# EAGLE schematic mediator (EAGLE 6.3)
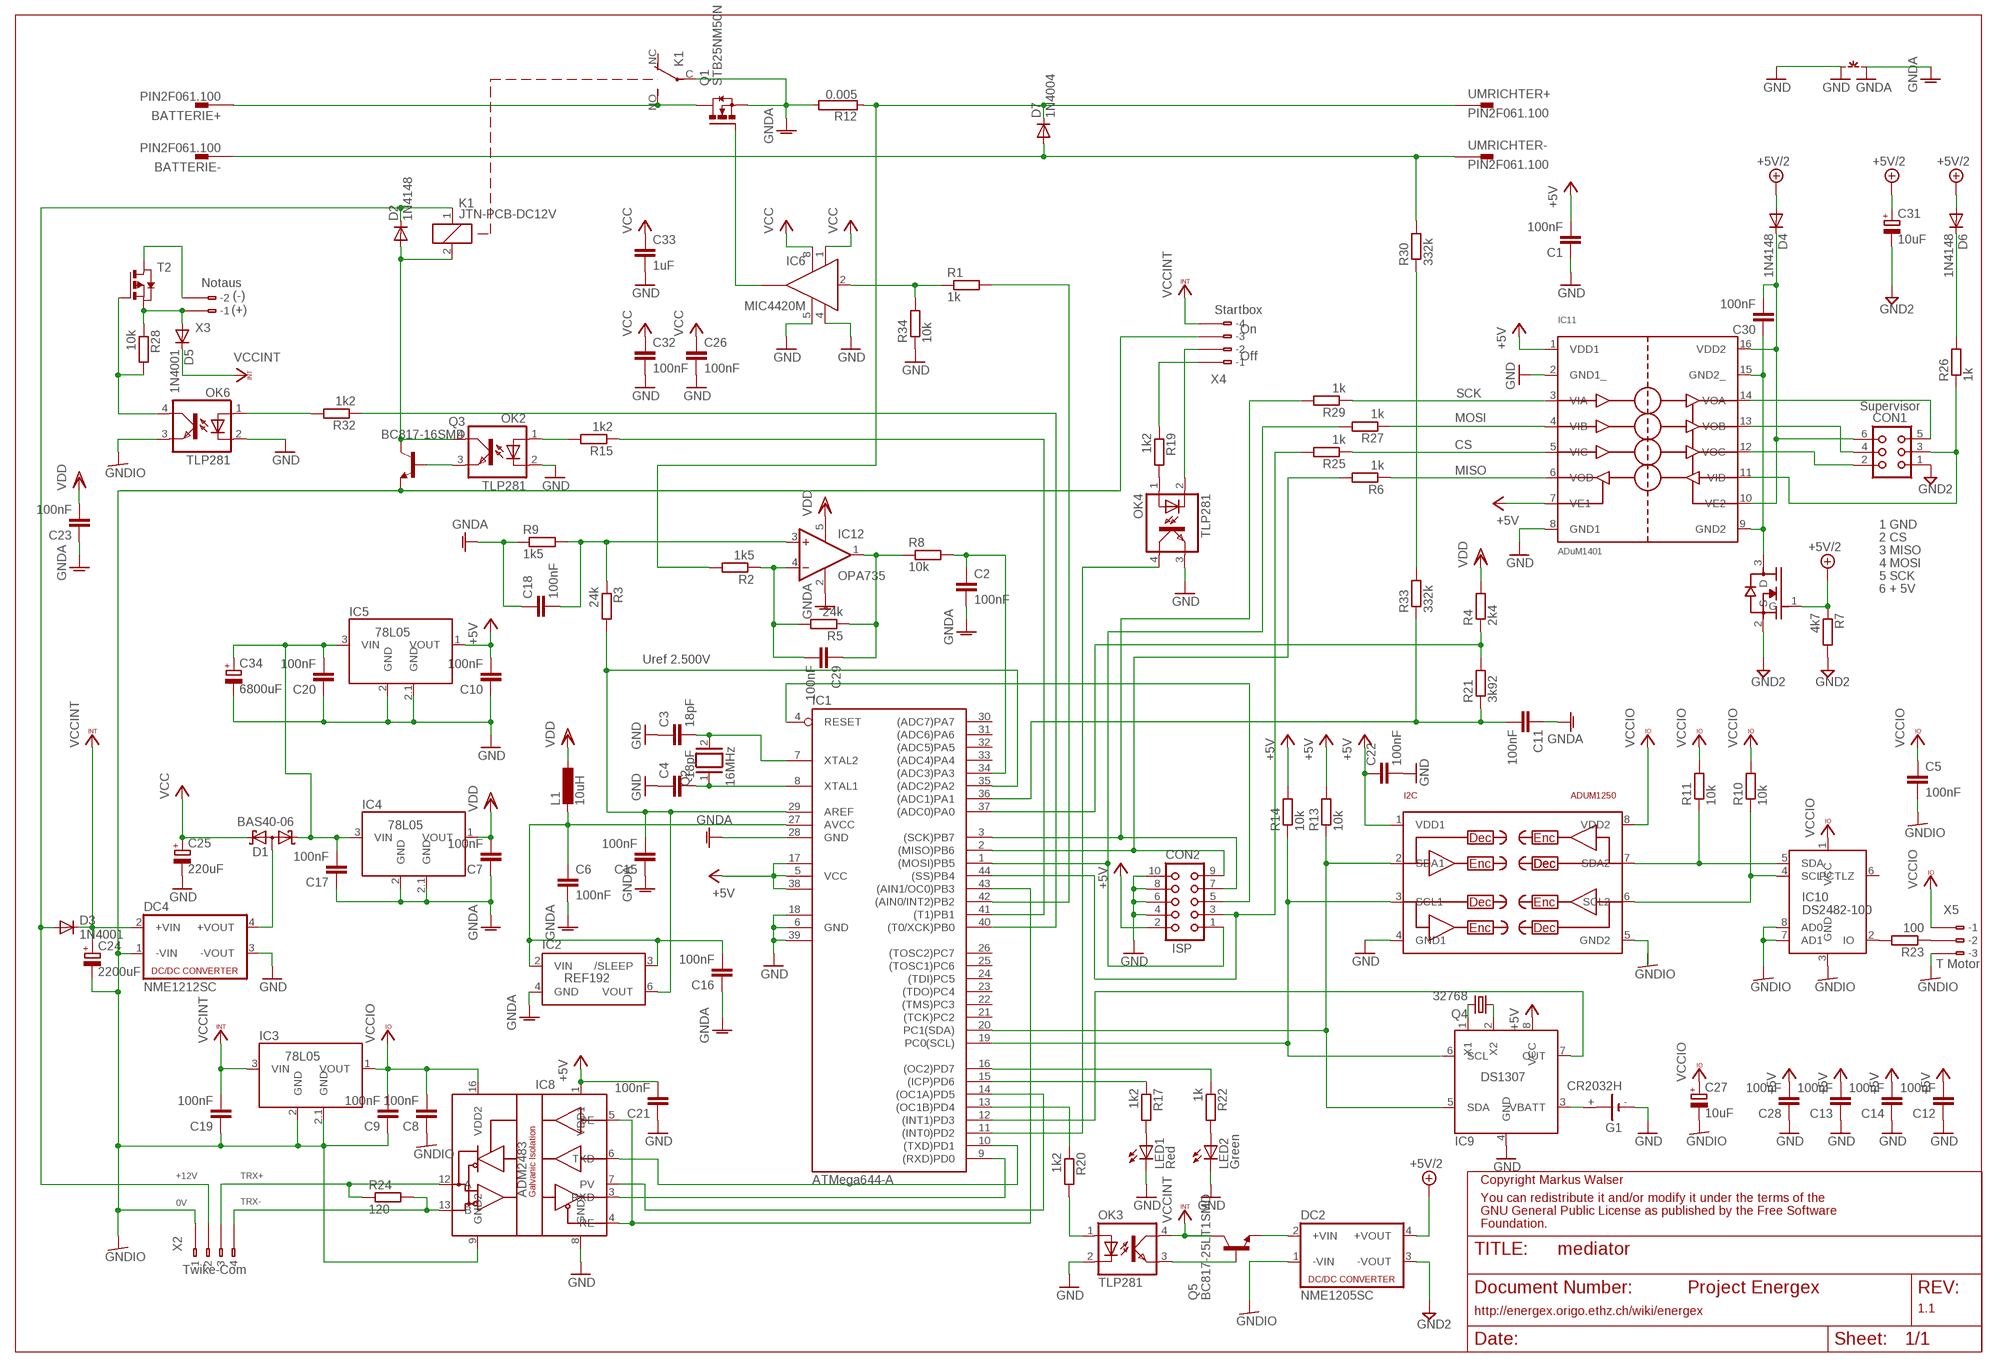
[diagram p0: schematic, sheet 1]

## Parts
BATTERIE+  PIN2F061.100  [F061.100]
BATTERIE-  PIN2F061.100  [F061.100]
C1  100nF  C-EUC0603K  [C0603K]
C2  100nF  C-EUC0603K  [C0603K]
C3  18pF  C-EUC0603K  [C0603K]
C4  18pF  C-EUC0603K  [C0603K]
C5  100nF  C-EUC0603K  [C0603K]
C6  100nF  C-EUC0603K  [C0603K]
C7  100nF  C-EUC0603K  [C0603K]
C8  100nF  C-EUC0603K  [C0603K]
C9  100nF  C-EUC0603K  [C0603K]
C10  100nF  C-EUC0603K  [C0603K]
C11  100nF  C-EUC0603K  [C0603K]
C12  100nF  C-EUC0603K  [C0603K]
C13  100nF  C-EUC0603K  [C0603K]
C14  100nF  C-EUC0603K  [C0603K]
C15  100nF  C-EUC0603K  [C0603K]
C16  100nF  C-EUC0603K  [C0603K]
C17  100nF  C-EUC0603K  [C0603K]
C18  100nF  C-EUC0603K  [C0603K]
C19  100nF  C-EUC0603K  [C0603K]
C20  100nF  C-EUC0603K  [C0603K]
C21  100nF  C-EUC0603K  [C0603K]
C22  100nF  C-EUC0603K  [C0603K]
C23  100nF  C-EUC0603K  [C0603K]
C24  2200uF  CPOL-EUE5-10.5  [E5-10,5]
C25  220uF  CPOL-EUE2.5-6  [E2,5-6]
C26  100nF  C-EUC0603K  [C0603K]
C27  10uF  CPOL-EUSMCA  [SMC_A]
C28  100nF  C-EUC0603K  [C0603K]
C29  100nF  C-EUC0603K  [C0603K]
C30  100nF  C-EUC0603K  [C0603K]
C31  10uF  CPOL-EUSMCA  [SMC_A]
C32  100nF  C-EUC0603K  [C0603K]
C33  1uF  C-EUC0603K  [C0603K]
C34  6800uF  CPOL-EUE7.5-16  [E7,5-16]
CON1  CON06  [CON06]
CON2  CON10  [CON10]
D1  BAS40-06  [SOT23]
D2  1N4148  DIODE-MICROMELF-R  [MICROMELF-R]
D3  1N4001  DIODE-DO214AC  [DO214AC]
D4  1N4148  DIODE-MICROMELF-R  [MICROMELF-R]
D5  1N4001  DIODE-DO214AC  [DO214AC]
D6  1N4148  DIODE-MICROMELF-R  [MICROMELF-R]
D7  1N4004  [DO41-10]
DC2  NME1205SC  NME  [NME]
DC4  NME1212SC  NME  [NME]
G1  CR2032H  [CR2032H]
I2C  ADUM1250  [SO8]
IC1  ATMega644-A  MEGA32-A  [TQFP44]
IC2  REF192  [SO08]
IC3  78L05  [SOT89]
IC4  78L05  [SOT89]
IC5  78L05  [SOT89]
IC6  MIC4420M  [SO-08]
IC8  ADM2483  [SO16W]
IC9  DS1307  [SO08]
IC10  DS2482-100  [SO08]
IC11  ADuM1401  ADUM1401  [SO16W]
IC12  OPA735  OPA743  [SOT23-5]
K1  JTN-PCB-DC12V  [JT-PCB]
L1  10uH  L-EUL3225M  [L3225M]
LED1  Red  LEDCHIPLED_0805  [CHIPLED_0805]
LED2  Green  LEDCHIPLED_0805  [CHIPLED_0805]
OK2  TLP281  TLP283  [MINI-FLAT-4]
OK3  TLP281  TLP283  [MINI-FLAT-4]
OK4  TLP281  TLP283  [MINI-FLAT-4]
OK6  TLP281  TLP283  [MINI-FLAT-4]
Q1  STB25NM50N  IRF3704S  [D2PACK]
Q2  16MHz  XTAL/S  [QS]
Q3  BC817-16SMD  [SOT23-BEC]
Q4  32768  CRYSTALTC26H  [TC26H]
Q5  BC817-25LT1SMD  [SOT23-BEC]
R1  1k  R-EU_R0603  [R0603]
R2  1k5  R-EU_M0805  [M0805]
R3  24k  R-EU_M0805  [M0805]
R4  2k4  R-EU_M0805  [M0805]
R5  24k  R-EU_M0805  [M0805]
R6  1k  R-EU_M0805  [M0805]
R7  4k7  R-EU_R0603  [R0603]
R8  10k  R-EU_M0805  [M0805]
R9  1k5  R-EU_M0805  [M0805]
R10  10k  R-EU_M0805  [M0805]
R11  10k  R-EU_M0805  [M0805]
R12  0.005  RKH208-8  [KH208-8]
R13  10k  R-EU_M0805  [M0805]
R14  10k  R-EU_M0805  [M0805]
R15  1k2  R-EU_R0603  [R0603]
R17  1k2  R-EU_R0603  [R0603]
R19  1k2  R-EU_R0603  [R0603]
R20  1k2  R-EU_R0603  [R0603]
R21  3k92  R-EU_M0805  [M0805]
R22  1k  R-EU_R0603  [R0603]
R23  100  R-EU_M0805  [M0805]
R24  120  R-EU_R0603  [R0603]
R25  1k  R-EU_M0805  [M0805]
R26  1k  R-EU_R0603  [R0603]
R27  1k  R-EU_M0805  [M0805]
R28  10k  R-EU_M0805  [M0805]
R29  1k  R-EU_M0805  [M0805]
R30  332k  R-EU_0207/10  [0207/10]
R32  1k2  R-EU_R0603  [R0603]
R33  332k  R-EU_0207/5V  [0207/5V]
R34  10k  R-EU_R0603  [R0603]
T1  FDN337N  [SOT23]
T2  PMOSSOT23  [SOT-23]
UMRICHTER+  PIN2F061.100  [F061.100]
UMRICHTER-  PIN2F061.100  [F061.100]
X2  233-104  [233-104]
X3  233-102  [233-102]
X4  233-104  [233-104]
X5  233-203  [233-203]
~NUDEV~1  GND-GNDA  [GND-GNDA]

## Nets
+5V: C1.2 C10.2 C12.2 C13.2 C14.2 C21.2 C22.1 C28.2 CON2.2 I2C.1(VDD1) IC1.5(VCC) IC1.17(VCC1) IC1.38(VCC2) IC5.1(VOUT) IC8.1(VDD1) IC9.8(VCC) IC11.1(VDD1) IC11.7(VE1) R13.2 R14.2
+5V/2: C31.+ D4.A D6.A DC2.4(+VOUT) R7.1 T1.1(G)
GND: C1.1 C3.1 C4.1 C10.1 C12.1 C13.1 C14.1 C20.1 C21.1 C22.2 C25.- C26.2 C28.1 C32.2 C33.2 C34.- CON2.4 CON2.6 CON2.8 CON2.10 DC4.3(-VOUT) G1.- I2C.4(GND1) IC1.6(GND) IC1.18(GND1) IC1.39(GND2) IC5.2(GND) IC5.2.1(GND) IC6.4(GND) IC6.5(GND1) IC8.8(GND1) IC9.4(GND) IC11.2(GND1_) IC11.8(GND1) LED1.C LED2.C OK2.2(C) OK3.2(C) OK4.3(EMIT) OK6.2(C) R34.1 ~NUDEV~1.GND
GND2: C31.- CON1.1 DC2.3(-VOUT) R7.2 T1.2(S)
GNDA: C2.2 C6.2 C7.1 C11.1 C15.1 C16.1 C17.1 C18.1 C23.1 IC1.28(GND) IC2.4(GND) IC4.2(GND) IC4.2.1(GND) IC12.2(V-) K1.C(P) Q1.3(S) R9.1 R12.2 ~NUDEV~1.GNDA
GNDIO: C5.2 C8.1 C9.1 C19.1 C24.- C27.- DC2.1(-VIN) DC4.1(-VIN) I2C.5(GND2) IC3.2(GND) IC3.2.1(GND) IC8.9(GND2) IC10.3(GND) IC10.7(AD1) IC10.8(AD0) OK6.3(EMIT) Q3.E X2.B1(B-1) X4.B3(B-3) X5.B3(B-3)
N$1: IC6.6(OUT) Q1.1(G)
N$2: BATTERIE+.A1 K1.NO(S) Q1.2(D)
N$3: IC9.1(X1) Q4.2
N$4: CON2.7 IC1.3((SCK)PB7) R29.2
N$5: C18.2 IC12.3(+IN) R3.1 R9.2
N$6: C29.2 IC12.4(-IN) R2.1 R5.2
N$7: C29.1 IC12.1(OUT) R5.1 R8.1
N$8: CON2.1 IC1.1((MOSI)PB5) R27.2
N$9: DC2.2(+VIN) Q5.E
N$10: CON2.3 IC1.44((SS)PB4) R25.2
N$11: C2.1 IC1.34((ADC3)PA3) R8.2
N$12: C3.2 IC1.7(XTAL2) Q2.2
N$13: C4.2 IC1.8(XTAL1) Q2.1
N$14: I2C.6(SCL2) IC10.4(SCL) R10.1
N$15: I2C.7(SDA2) IC10.5(SDA) R11.1
N$16: D7.C R2.2 R12.1 UMRICHTER+.A1
N$17: IC10.2(IO) R23.2
N$18: BATTERIE-.A1 D7.A R30.2 UMRICHTER-.A1
N$19: IC1.37((ADC0)PA0) R4.1 R21.2
N$20: OK2.3(EMIT) Q3.B
N$21: OK2.1(A) R15.2
N$22: C6.1 C16.2 IC1.27(AVCC) IC2.2(VIN) IC2.3(/SLEEP) L1.2
N$23: I2C.2(SDA1) IC1.20(PC1(SDA)) IC9.5(SDA) R13.1
N$24: I2C.3(SCL1) IC1.19(PC0(SCL)) IC9.6(SCL) R14.1
N$25: IC1.41((T1)PB1) R15.1
N$26: D2.C D3.A K1.1 X2.B2(B-2)
N$27: IC1.15((ICP)PD6) R17.1
N$28: D2.A K1.2 OK2.4(COL) Q3.C
N$29: IC1.9((RXD)PD0) IC8.3(RXD)
N$30: CON2.9 IC1.2((MISO)PB6) R6.2
N$31: IC1.42((AIN0/INT2)PB2) R1.2
N$32: IC11.6(VOD) R6.1
N$33: D5.A R28.1 T2.2(S) X3.B1(B-1)
N$34: IC1.10((TXD)PD1) IC8.6(TXD)
N$35: CON1.2 IC11.12(VOC)
N$36: IC8.13(B) R24.2 X2.B4(B-4)
N$37: IC1.16((OC2)PD7) R22.1
N$38: IC8.12(A) R24.1 X2.B3(B-3)
N$39: IC1.43((AIN1/OC0)PB3) IC8.4(RE) IC8.5(DE)
N$40: IC1.14((OC1A)PD5) IC8.7(PV)
N$41: R23.1 X5.B2(B-2)
N$42: R30.1 R33.2
N$43: T2.1(D) X3.B2(B-2)
N$44: C30.1 IC11.9(GND2) IC11.15(GND2_) T1.3(D)
N$45: OK3.3(EMIT) Q5.B
N$46: OK3.1(A) R20.2
N$47: IC1.13((OC1B)PD4) R20.1
N$48: IC1.11((INT0)PD2) OK4.4(COL)
N$49: OK4.2(C) X4.B2(B-2)
N$50: OK4.1(A) R19.2
N$51: G1.+ IC9.3(VBATT)
N$52: CON1.3 IC11.11(VID) R26.1
N$53: CON1.4 IC11.13(VOB)
N$54: CON2.5 IC1.4(RESET)
N$55: CON1.5 IC11.14(VOA)
N$57: LED1.A R17.2
N$58: R19.1 X4.B1(B-1)
N$59: C15.2 IC1.29(AREF) IC1.35((ADC2)PA2) IC2.6(VOUT) R3.2
N$60: IC1.12((INT1)PD3) IC9.7(OUT)
N$61: C30.2 CON1.6 D4.C IC11.10(VE2) IC11.16(VDD2)
N$62: C17.2 C20.2 C34.+ D1.1(K1) IC4.3(VIN) IC5.3(VIN)
N$63: IC9.2(X2) Q4.1
N$64: LED2.A R22.2
N$65: IC6.2(IN) R1.1 R34.2
N$66: D1.3(AA) DC4.4(+VOUT)
N$67: C11.2 IC1.36((ADC1)PA1) R21.1 R33.1
N$69: D6.C R26.2
N$70: IC11.5(VIC) R25.1
N$71: IC11.4(VIB) R27.1
N$72: IC11.3(VIA) R29.1
N$73: OK6.4(COL) R28.2 T2.3(G)
N$74: OK6.1(A) R32.2
N$76: IC1.40((T0/XCK)PB0) R32.1
VCC: C25.+ C26.1 C32.1 C33.1 D1.2(K2) IC6.1(VS) IC6.8(VS1)
VCCINT: C19.2 C24.+ D3.C D5.C DC4.2(+VIN) IC3.3(VIN) OK3.4(COL) Q5.C X4.B4(B-4)
VCCIO: C5.1 C8.2 C9.2 C27.+ I2C.8(VDD2) IC3.1(VOUT) IC8.16(VDD2) IC10.1(VCC) R10.2 R11.2 X5.B1(B-1)
VDD: C7.2 C23.2 IC4.1(VOUT) IC12.5(V+) L1.1 R4.2
Unconnected: BATTERIE+.A2(1.1) BATTERIE-.A2(1.1) G1.+@1(+) IC1.21((TCK)PC2) IC1.22((TMS)PC3) IC1.23((TDO)PC4) IC1.24((TDI)PC5) IC1.25((TOSC1)PC6) IC1.26((TOSC2)PC7) IC1.30((ADC7)PA7) IC1.31((ADC6)PA6) IC1.32((ADC5)PA5) IC1.33((ADC4)PA4) IC6.7(OUT) IC10.6(PCTLZ) K1.NC(O) UMRICHTER+.A2(1.1) UMRICHTER-.A2(1.1) X2.A1(-1) X2.A2(-2) X2.A3(-3) X2.A4(-4) X3.A1(-1) X3.A2(-2) X4.A1(-1) X4.A2(-2) X4.A3(-3) X4.A4(-4) X5.A1(-1) X5.A2(-2) X5.A3(-3)

## Notes on the sheet
- Notaus
- (-)
- (+) | Startbox
- On
- Off
- SCK
- Supervisor
- MOSI
- CS
- MISO
- 1 GND
- 2 CS
- 3 MISO
- 4 MOSI
- 5 SCK
- 6 + 5V
- Uref 2.500V
- ISP
- T Motor
- +12V | TRX+
- Copyright Markus Walser
- TRX- | You can redistribute it and/or modify it under the terms of the
- 0V
- GNU General Public License as published by the Free Software
- Foundation.
- Twike-Com
- Project Energex
- http://energex.origo.ethz.ch/wiki/energex | 1.1

## Library data of the parts
BATTERIE+ BATTERIE- UMRICHTER+ UMRICHTER- = con-faston:PIN2: Flachstecker Typ Tyco/Electronics/AMP TAB, FASTON Printed Circuit Board Tabs Source: http://www.buerklin.com, http://catalog.tycoelectronics.com; OC_FARNELL: unknown; OC_NEWARK: unknown
C1-C23 C26 C28-C30 C32 C33 = rcl:C-EU: CAPACITOR, European symbol
C24 C25 C27 C31 C34 = rcl:CPOL-EU: POLARIZED CAPACITOR, European symbol
CON1 = con-harting:CON06: CONNECTOR; OC_FARNELL: unknown; OC_NEWARK: unknown
CON2 = con-harting:CON10: CONNECTOR; OC_FARNELL: unknown; OC_NEWARK: unknown
D1 = diode:BAS40-06: Silicon Schottky Diodes General-purpose diode for high-speed switching
D2-D6 = diode:DIODE-: DIODE
D7 = diode:1N4004: DIODE general purpose rectifier, 1 A
DC2 DC4 = dc-dc-converter:NME: DC-DC CONVERTER; MF: C & D TECHNOLOGIES, INC; MPN: NME1205D; OC_FARNELL: 1021466; OC_NEWARK: 98B8198
G1 = mediator:CR2032H: LI BATTERY Varta
I2C = analog-devices:ADUM1250
IC1 = atmel:MEGA32: MICROCONTROLLER 32 Kbytes FLASH 2 Kbytes SRAM 1 Kbytes EEPROM USART 8-channel 10 bit ADC Source: www.atmel.com .. doc2503.pdf; MPN: ATMEGA32-16AU; OC_FARNELL: 9171274; OC_NEWARK: 69K6677
IC2 = icontroller:REF192
IC3-IC5 = icontroller:78L05: Negative voltage regulators
IC6 = transistor-power:MIC4420: 6A-Peak Low-Side MOSFET Driver Bipolar/CMOS/DMOS Process http://www.micrel.com/_PDF/mic4420.pdf
IC8 = icontroller:ADM2483: RS-485 Transceiver, iCoupler® Isolated, Half-Duplex
IC9 = icontroller:DS1307: 64 x 8, Serial, I2C Real-Time Clock
IC10 = icontroller:DS2482-100: Single-Channel 1-Wire Master
IC11 = spisolator:ADUM1401: Quad-Channel Digital Isolators The ADuM1401 is a 3/1 quad-channel digital isolators based on Analog Devices, Inc., iCoupler® technology. Combining high speed CMOS and monolithic air core transformer technology, these isolation components provide outstanding performance characteristics superior to alternatives, such as optocoupler devices.
IC12 = linear:OPA743: 12V, 7MHz, CMOS, Rail-to-Rail I/O OP AMP Source: http://focus.ti.com/lit/ds/sbos201/sbos201.pdf
K1 = relay:JT?-*: COMPACT ECONOMICAL 30 AMP. RELAY NAiS Source: http://www.mew-europe.com/.. en_ds_61212_0000.pdf; OC_FARNELL: unknown; OC_NEWARK: unknown
L1 = rcl:L-EU: INDUCTOR, European symbol
LED1 LED2 = led:LED: LED OSRAM: - CHIPLED LG R971, LG N971, LY N971, LG Q971, LY Q971, LO R971, LY R971 LH N974, LH R974 LS Q976, LO Q976, LY Q976 LO Q996 - Hyper CHIPLED LW Q18S LB Q993, LB Q99A, LB R99A - SideLED LS A670, LO A670, LY A670, LG A670, LP A670 LB A673, LV A673, LT A673, LW A673 LH A674 LY A675 LS A676, LA A676, LO A676, LY A676, LW A676 LS A679, LY A679, LG A679 - Hyper Micro SIDELED® LS Y876, LA Y876, LO Y876, LY Y876 LT Y87S - SmartLED LW L88C, LW L88S LB L89C, LB L89S, LG L890 LS L89K, LO L89K, LY L89K LS L896, LA L896, LO L896, LY L896 - TOPLED LS T670, LO T670, LY T670, LG T670, LP T670 LSG T670, LSP T670, LSY T670, LOP T670, LYG T670 LG T671, LOG T671, LSG T671 LB T673, LV T673, LT T673, LW T673 LH T674 LS T676, LA T676, LO T676, LY T676, LB T676, LH T676, LSB T676, LW T676 LB T67C, LV T67C, LT T67C, LS T67K, LO T67K, LY T67K, LW E67C LS E67B, LA E67B, LO E67B, LY E67B, LB E67C, LV E67C, LT E67C LW T67C LS T679, LY T679, LG T679 LS T770, LO T770, LY T770, LG T770, LP T770 LB T773, LV T773, LT T773, LW T773 LH T774 LS E675, LA E675, LY E675, LS T675 LS T776, LA T776, LO T776, LY T776, LB T776 LHGB T686 LT T68C, LB T68C - Hyper Mini TOPLED® LB M676 - Mini TOPLED Santana® LG M470 LS M47K, LO M47K, LY M47K Source: http://www.osram.convergy.de LUXEON: - LUMILED® LXK2-PW12-R00, LXK2-PW12-S00, LXK2-PW14-U00, LXK2-PW14-V00 LXK2-PM12-R00, LXK2-PM12-S00, LXK2-PM14-U00 LXK2-PE12-Q00, LXK2-PE12-R00, LXK2-PE12-S00, LXK2-PE14-T00, LXK2-PE14-U00 LXK2-PB12-K00, LXK2-PB12-L00, LXK2-PB12-M00, LXK2-PB14-N00, LXK2-PB14-P00, LXK2-PB14-Q00 LXK2-PR12-L00, LXK2-PR12-M00, LXK2-PR14-Q00, LXK2-PR14-R00 LXK2-PD12-Q00, LXK2-PD12-R00, LXK2-PD12-S00 LXK2-PH12-R00, LXK2-PH12-S00 LXK2-PL12-P00, LXK2-PL12-Q00, LXK2-PL12-R00 Source: www.luxeon.com KINGBRIGHT: KA-3528ASYC Source: www.kingbright.com
OK2-OK4 OK6 = optocoupler:TLP283: TOSHIBA PHOTOCOUPLER GaAs IRED & PHOTO-TRANSISTOR Source: http://www.semicon.toshiba.co.jp/td/en/Opto/Photocoupler/en_20050928_TLP283_datasheet.pdf; OC_FARNELL: unknown; OC_NEWARK: unknown
Q1 = transistor-power:IRF3704: SMPS MOSFET HEXFET® Power MOSFET Source: http://www.irf.com/product-info/datasheets/data/irf3704.pdf
Q2 = special:XTAL/S: CRYSTAL
Q3 Q5 = transistor-npn:BC817*: NPN Transistor
Q4 = crystal:CRYSTAL: CRYSTAL; OC_FARNELL: unknown; OC_NEWARK: unknown
R1-R11 R13-R15 R17 R19-R30 R32-R34 = rcl:R-EU_: RESISTOR, European symbol
R12 = resistor-power:R: Power Resitor; OC_FARNELL: unknown; OC_NEWARK: unknown
T1 = supervisor:FDN337N: N-Channel Logic Level Enhancement Mode Field Effect Transistor
T2 = zetex:PMOSSOT23: MOS FET; OC_FARNELL: unknown; OC_NEWARK: unknown
X2 X4 = con-wago:233-104: WAGO Cage Clamp; MPN: 233-104; OC_FARNELL: unknown; OC_NEWARK: 28K9046
X3 = con-wago:233-102: WAGO Cage Clamp; MPN: 233-102; OC_FARNELL: unknown; OC_NEWARK: 28K9044
X5 = con-wago:233-203: WAGO Cage Clamp; MPN: 233-203; OC_FARNELL: 1283533; OC_NEWARK: 28K9060
~NUDEV~1 = supply1:GND-GNDA: Example of GND--GNDA NET-Connetor for more info see description in package